# Altium schematic sheet WL-ADC.SchDoc
size 420 x 297 mm; Scale: 1:1; DocumentType: Схема электрическая принципиальная; FirstReferrence: UA3REO/R7KBI; DocumentNumber: 4; SheetNumber: 4; SheetTotal: 12
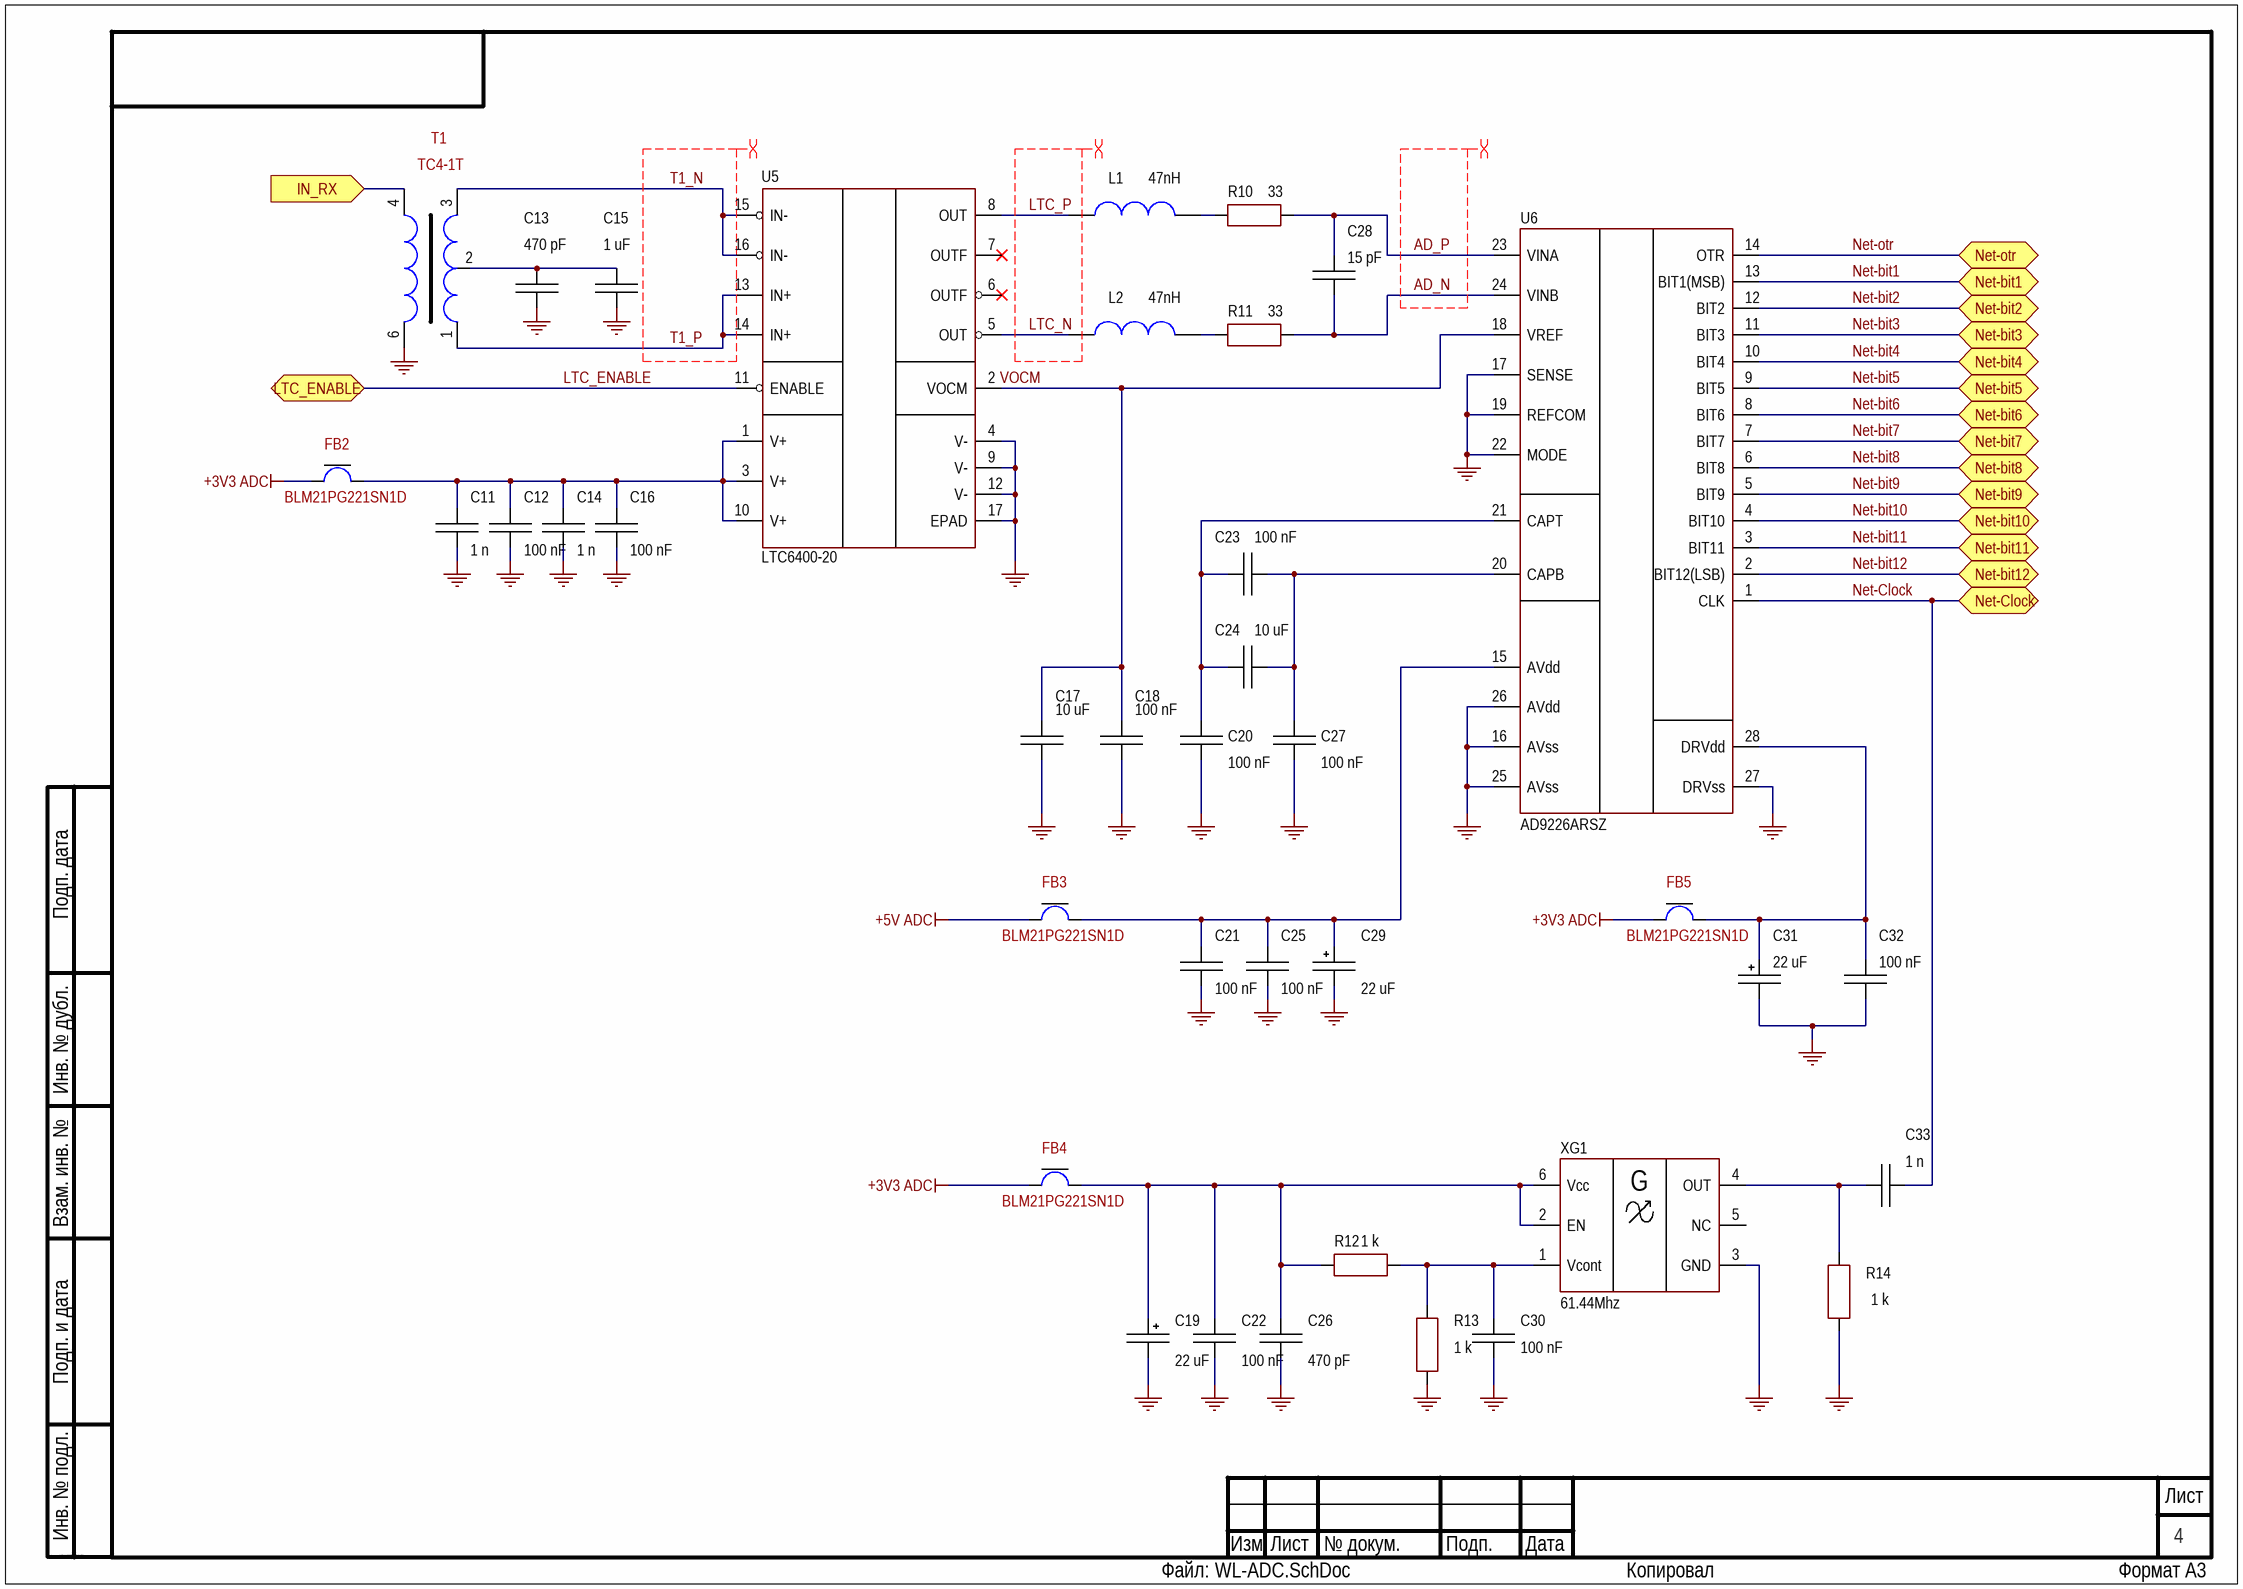
[diagram p0: WL-ADC.SchDoc]

## Parts
C11  1 n  [C-0805-0.7]
C12  100 nF  [C-0805-0.95]
C13  470 pF  [C-0805-0.7]
C14  1 n  [C-0805-0.7]
C15  1 uF  [C-0805-1.25]
C16  100 nF  [C-0805-0.95]
C17  10 uF  [C-0805-1.25]
C18  100 nF  [C-0805-0.95]
C19  22 uF  [CAP-CASE B]
C20  100 nF  [C-0805-0.95]
C21  100 nF  [C-0805-0.95]
C22  100 nF  [C-0805-0.95]
C23  100 nF  [C-0805-0.95]
C24  10 uF  [C-0805-1.25]
C25  100 nF  [C-0805-0.95]
C26  470 pF  [C-0805-0.7]
C27  100 nF  [C-0805-0.95]
C28  15 pF  [C-0805-0.7]
C29  22 uF  [CAP-CASE B]
C30  100 nF  [C-0805-0.95]
C31  22 uF  [CAP-CASE B]
C32  100 nF  [C-0805-0.95]
C33  1 n  [C-0805-0.7]
FB2  BLM21PG221SN1D  [L-0805]
FB3  BLM21PG221SN1D  [L-0805]
FB4  BLM21PG221SN1D  [L-0805]
FB5  BLM21PG221SN1D  [L-0805]
L1  47nH  [L-1210]
L2  47nH  [L-1210]
R10  33  [R-0805]
R11  33  [R-0805]
R12  1 k  [R-0805]
R13  1 k  [R-0805]
R14  1 k  [R-0805]
T1  TC4-1T  [TC4-1T]
U5  LTC6400-20  [EQFN-16]
U6  AD9226ARSZ  [SSOP-28]
XG1  61.44Mhz  [VCXO]

## Ports
IN_RX (in), LTC_ENABLE (bidir), Net-bit1 (bidir), Net-bit2 (bidir), Net-bit3 (bidir), Net-bit4 (bidir), Net-bit5 (bidir), Net-bit6 (bidir), Net-bit7 (bidir), Net-bit8 (bidir), Net-bit9 (bidir), Net-bit10 (bidir), Net-bit11 (bidir), Net-bit12 (bidir), Net-Clock (bidir), Net-otr (bidir)

## Nets
+3V3 ADC: FB2.1 FB4.2 FB5.1
+5V ADC: FB3.1
GND: C11.1 C12.1 C13.2 C14.1 C15.1 C16.1 C17.2 C18.1 C19.2 C20.1 C21.1 C22.2 C25.1 C26.2 C27.1 C29.2 C30.2 C31.2 C32.1 R13.2 R14.1 T1.6 U5.4(V-) U5.9(V-) U5.12(V-) U5.17(EPAD) U6.16(AVss) U6.17(SENSE) U6.19(REFCOM) U6.22(MODE) U6.25(AVss) U6.26(AVdd) U6.27(DRVss) XG1.3(GND)
AD_N: C28.1 R11.2 U6.24(VINB)
AD_P: C28.2 R10.2 U6.23(VINA)
IN_RX: T1.4 ; port IN_RX
LTC_ENABLE: U5.11(ENABLE) ; port LTC_ENABLE
LTC_N: L2.1 U5.5(OUT)
LTC_P: L1.1 U5.8(OUT)
Net-bit1: U6.13(BIT1(MSB)) ; port Net-bit1
Net-bit2: U6.12(BIT2) ; port Net-bit2
Net-bit3: U6.11(BIT3) ; port Net-bit3
Net-bit4: U6.10(BIT4) ; port Net-bit4
Net-bit5: U6.9(BIT5) ; port Net-bit5
Net-bit6: U6.8(BIT6) ; port Net-bit6
Net-bit7: U6.7(BIT7) ; port Net-bit7
Net-bit8: U6.6(BIT8) ; port Net-bit8
Net-bit9: U6.5(BIT9) ; port Net-bit9
Net-bit10: U6.4(BIT10) ; port Net-bit10
Net-bit11: U6.3(BIT11) ; port Net-bit11
Net-bit12: U6.2(BIT12(LSB)) ; port Net-bit12
Net-Clock: C33.2 U6.1(CLK) ; port Net-Clock
Net-otr: U6.14(OTR) ; port Net-otr
T1_N: T1.3 U5.15(IN-) U5.16(IN-)
T1_P: T1.1 U5.13(IN+) U5.14(IN+)
VOCM: C17.1 C18.2 U5.2(VOCM) U6.18(VREF)
NetC11_2: C11.2 C12.2 C14.2 C16.2 FB2.2 U5.1(V+) U5.3(V+) U5.10(V+)
NetC13_1: C13.1 C15.2 T1.2
NetC19_1: C19.1 C22.1 C26.1 FB4.1 R12.1 XG1.2(EN) XG1.6(Vcc)
NetC20_2: C20.2 C23.1 C24.1 U6.21(CAPT)
NetC21_2: C21.2 C25.2 C29.1 FB3.2 U6.15(AVdd)
NetC23_2: C23.2 C24.2 C27.2 U6.20(CAPB)
NetC30_1: C30.1 R12.2 R13.1 XG1.1(Vcont)
NetC31_1: C31.1 C32.2 FB5.2 U6.28(DRVdd)
NetC33_1: C33.1 R14.2 XG1.4(OUT)
NetL1_2: L1.2 R10.1
NetL2_2: L2.2 R11.1

Not connected (* = marked no-connect by the designer): U5 6(OUTF)* 7(OUTF)*; XG1 5(NC)

## Layout directives
differential pair: AD_N, AD_P, LTC_N, LTC_P, T1_N, T1_P

## Notes on the sheet
- Подп. дата
- Инв. № дубл.
- Взам. инв. №
- Подп. и дата
- Инв. № подл.
- Изм.
- Лист
- № докум.
- Подп.
- Дата
- ALTIUM GOSTBOM2.0 KEV
- Файл:
- Копировал
- Формат А3
- (in symbol VCXO) G

## Library data of the parts
C11 C14 C33 = CC0805JRNPO9BN102: Manufacturer: Yageo; Value: 1; Type: Конденсатор; Dielectric: NPO; Units: nF; Tolerance: ±5%; Voltage: 50 V; Value+Units: 1 nF; CommentDOC: ( CC - 0805 - NPO - 50 V - 1 nF ±5% ); Part Number: CC0805JRNPO9BN102; Case: 0805; Operating Temperature: -55 ... 125 °C; Series: CC; ValueSCH: 1 n; ( Series - Case - Dielectric -  Voltage - Value+Units Tolerance: ( CC - 0805 - NPO - 50 V - 1 nF ±5% )
C12 C16 C18 C20-C23 C25 C27 C30 C32 = CC0805KRX7R9BB104: Manufacturer: Yageo; Value: 100; Type: Конденсатор; Dielectric: X7R; Tolerance: ±10%; Voltage: 50 V; CommentDOC: ( CC - 0805 - X7R - 50 V - 100 nF ±10% ); Part Number: CC0805KRX7R9BB104; Units: nF; Case: 0805; Operating Temperature: -55 ... 125 °C; Series: CC; Value+Units: 100 nF; ValueSCH: 100 nF; ( Series - Case - Dielectric -  Voltage - Value+Units Tolerance: ( CC - 0805 - X7R - 50 V - 100 nF ±10% )
C13 C26 = CC0805JRNPO9BN471: Manufacturer: Yageo; Value: 470; Type: Конденсатор; Dielectric: NPO; Tolerance: ±5%; Voltage: 50 V; CommentDOC: ( CC - 0805 - NPO - 50 V - 470 pF ±5% ); Part Number: CC0805JRNPO9BN471; Units: pF; Case: 0805; Operating Temperature: -55 ... 125 °C; Series: CC; Value+Units: 470 pF; ValueSCH: 470 pF; ( Series - Case - Dielectric -  Voltage - Value+Units Tolerance: ( CC - 0805 - NPO - 50 V - 470 pF ±5% )
C15 = CC0805KKX7R9BB105: Manufacturer: Yageo; Value: 1; Type: Конденсатор; Dielectric: X7R; Tolerance: ±10%; Voltage: 50 V; CommentDOC: ( CC - 0805 - X7R - 50 V - 1 uF ±10% ); Part Number: CC0805KKX7R9BB105; Units: uF; Case: 0805; Operating Temperature: -55 ... 125 °C; Series: CC; Value+Units: 1 uF; ValueSCH: 1 uF; ( Series - Case - Dielectric -  Voltage - Value+Units Tolerance: ( CC - 0805 - X7R - 50 V - 1 uF ±10% )
C17 C24 = CL21B106KOQNNNE: Manufacturer: Samsung Electro-Mechanics; Value: 10; Type: Конденсатор; Dielectric: X7R; Tolerance: ±10%; Voltage: 16 V; CommentDOC: ( CL - 0805 - X7R - 16 V - 10 uF ±10% ); Part Number: CL21B106KOQNNNE; Units: uF; Case: 0805; Operating Temperature: -55 ... 125 °C; Series: CL; Value+Units: 10 uF; ValueSCH: 10 uF; ( Series - Case - Dielectric -  Voltage - Value+Units Tolerance: ( CL - 0805 - X7R - 16 V - 10 uF ±10% )
C19 C29 C31 = EEE-1CA220WAR: Manufacturer: Panasonic Electronic Components; Type: Конденсатор; Value: 22; Tolerance: ±20%; Voltage: 16 V; CommentDOC: ( S - 16 V - 22  uF  ±20% ); Part Number: EEE-1CA220WAR; Units: uF; Case: 4x5.4; Operating Temperature: -40 ... 85 °C; Series: S; ValueSCH: 22 uF; ( Series - Voltage - Value  Units  Tolerance ): ( S - 16 V - 22  uF  ±20% )
C28 = CC0805JRNPO9BN150: Manufacturer: Yageo; Value: 15; Type: Конденсатор; Dielectric: NPO; Tolerance: ±5%; Voltage: 50 V; CommentDOC: ( CC - 0805 - NPO - 50 V - 15 pF ±5% ); Part Number: CC0805JRNPO9BN150; Units: pF; Case: 0805; Operating Temperature: -55 ... 125 °C; Series: CC; Value+Units: 15 pF; ValueSCH: 15 pF; ( Series - Case - Dielectric -  Voltage - Value+Units Tolerance: ( CC - 0805 - NPO - 50 V - 15 pF ±5% )
FB2-FB5 = BLM21PG221SN1D: Manufacturer: Murata Electronics; Type: Ферритовая бусина; Part Number: BLM21PG221SN1D; Series: EMIFIL; Case: 0805; ValueSCH: BLM21PG221SN1D; Operating Temperature: −55°C ... 125°C
L1 L2 = FHW1210HC047JGT: Manufacturer: FH(Guangdong Fenghua Advanced Tech); Type: Дроссель; Part Number: FHW1210HC047JGT; Series: FHW; Case: 1210; ValueSCH: 47nH
R10 R11 = RC0805JR-0733RL: Manufacturer: Yageo; Power: 0,125 W; Units: Ohm; Tolerance: ±5%; Operating Voltage: 150 V; Value+Units: 33 Ohm; CommentDOC: ( RC - 0805 - 0,125 W - 33 Ohm  ±5% ); Value: 33; Type: Резистор; Part Number: RC0805JR-0733RL; Case: 0805; Operating Temperature: -55°C ... 155°C; ValueSCH: 33; Series: RC
R12-R14 = RC0805JR-071KL: Manufacturer: Yageo; Value: 1; Power: 0,125 W; Units: kOhm; Tolerance: ±5%; Operating Voltage: 150 V; Value+Units: 1 kOhm; CommentDOC: ( RC - 0805 - 0,125 W - 1 kOhm  ±5% ); Type: Резистор; Part Number: RC0805JR-071KL; Case: 0805; Operating Temperature: -55°C ... 155°C; ValueSCH: 1 k; Series: RC
T1 = TC4-1T: Manufacturer: Mini-Circuits; Type: Трансформатор; Part Number: TC4-1T; Case: AT224-1A; Operating Temperature: −20°C ... 85°C
U5 = LTC6400-20: Manufacturer: Analog Devices Inc.; Voltage  Supply: +2,85 V...±3.5 V; Part Number: LTC6400-20; Case: EQFN-16; Operating Temperature: −40°C … 85°C; Type: Микросхема
U6 = AD9226ARSZ: IC ADC 12BIT; Manufacturer: Analog Devices Inc.; Voltage  Supply A/D: 5,0 V/2,85 V … 5,25 V; Part Number: AD9226ARSZ; Function: IC ADC 12BIT; Case: SSOP-28; Operating Temperature: -40°C …  85°C; Type: Микросхема
XG1 = VCXO: Value: 61,44Mhz; Part Number: VCXO; Case: VCXO; Type: Кварцевый генератор